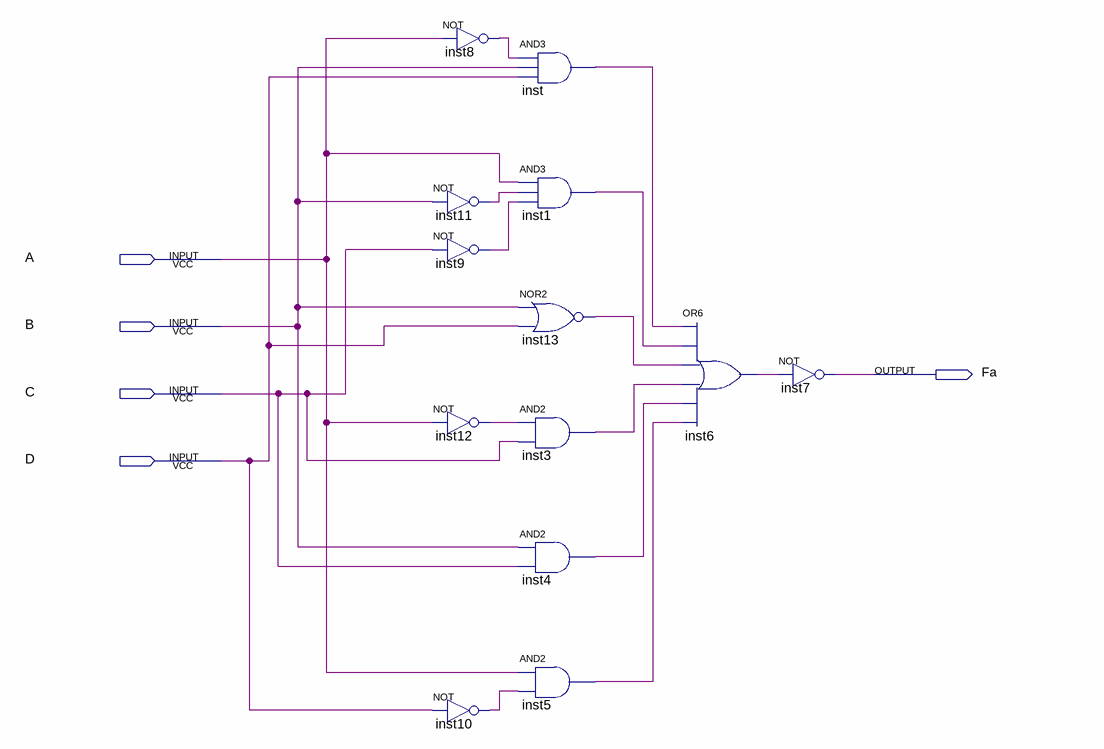
[diagram p0: schematic sheet]
// Quartus schematic fa.bdf as structural Verilog: 13 symbols, 5 pins
module fa (
  input  A,
  input  B,
  input  C,
  input  D,
  output Fa
);

  wire inst1_out, inst3_out, inst4_out, inst5_out, inst6_out, inst8_out, inst9_out, inst10_out, inst11_out,
       inst12_out, inst13_out, inst_out;

  not inst8 (inst8_out, A);
  not inst11 (inst11_out, B);
  not inst9 (inst9_out, C);
  not inst12 (inst12_out, A);
  not inst10 (inst10_out, D);
  and inst (inst_out, inst8_out, B, D);
  and inst1 (inst1_out, A, inst11_out, inst9_out);
  nor inst13 (inst13_out, B, D);
  and inst3 (inst3_out, inst12_out, C);
  and inst4 (inst4_out, B, C);
  and inst5 (inst5_out, A, inst10_out);
  or inst6 (inst6_out, inst_out, inst1_out, inst13_out, inst3_out, inst4_out, inst5_out);
  not inst7 (Fa, inst6_out);
endmodule
